# EAGLE board proiect (EAGLE 9.7.0)
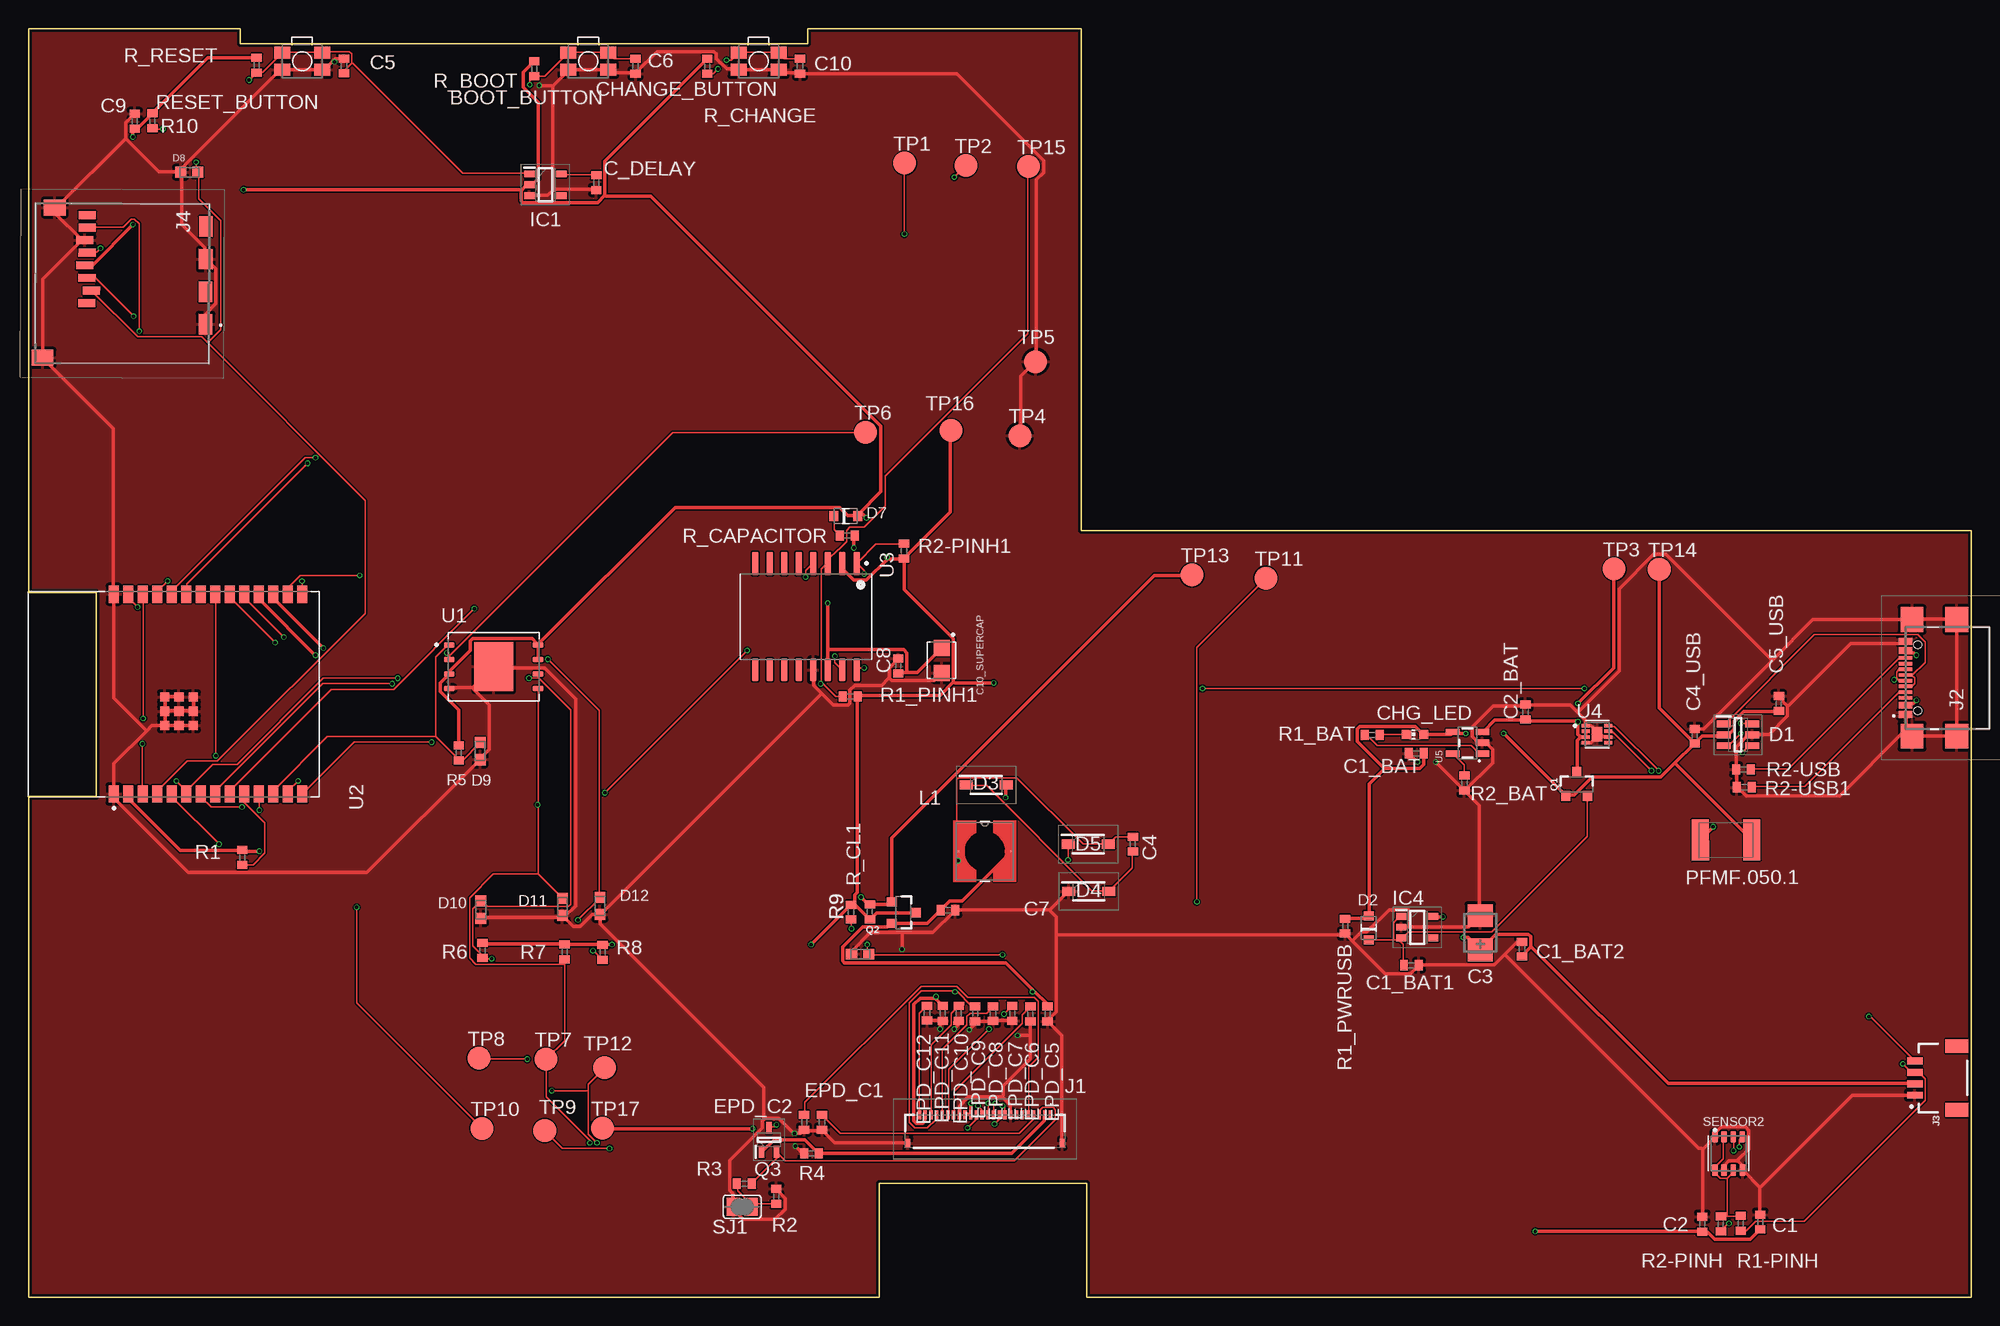
[diagram p1: board, top side]
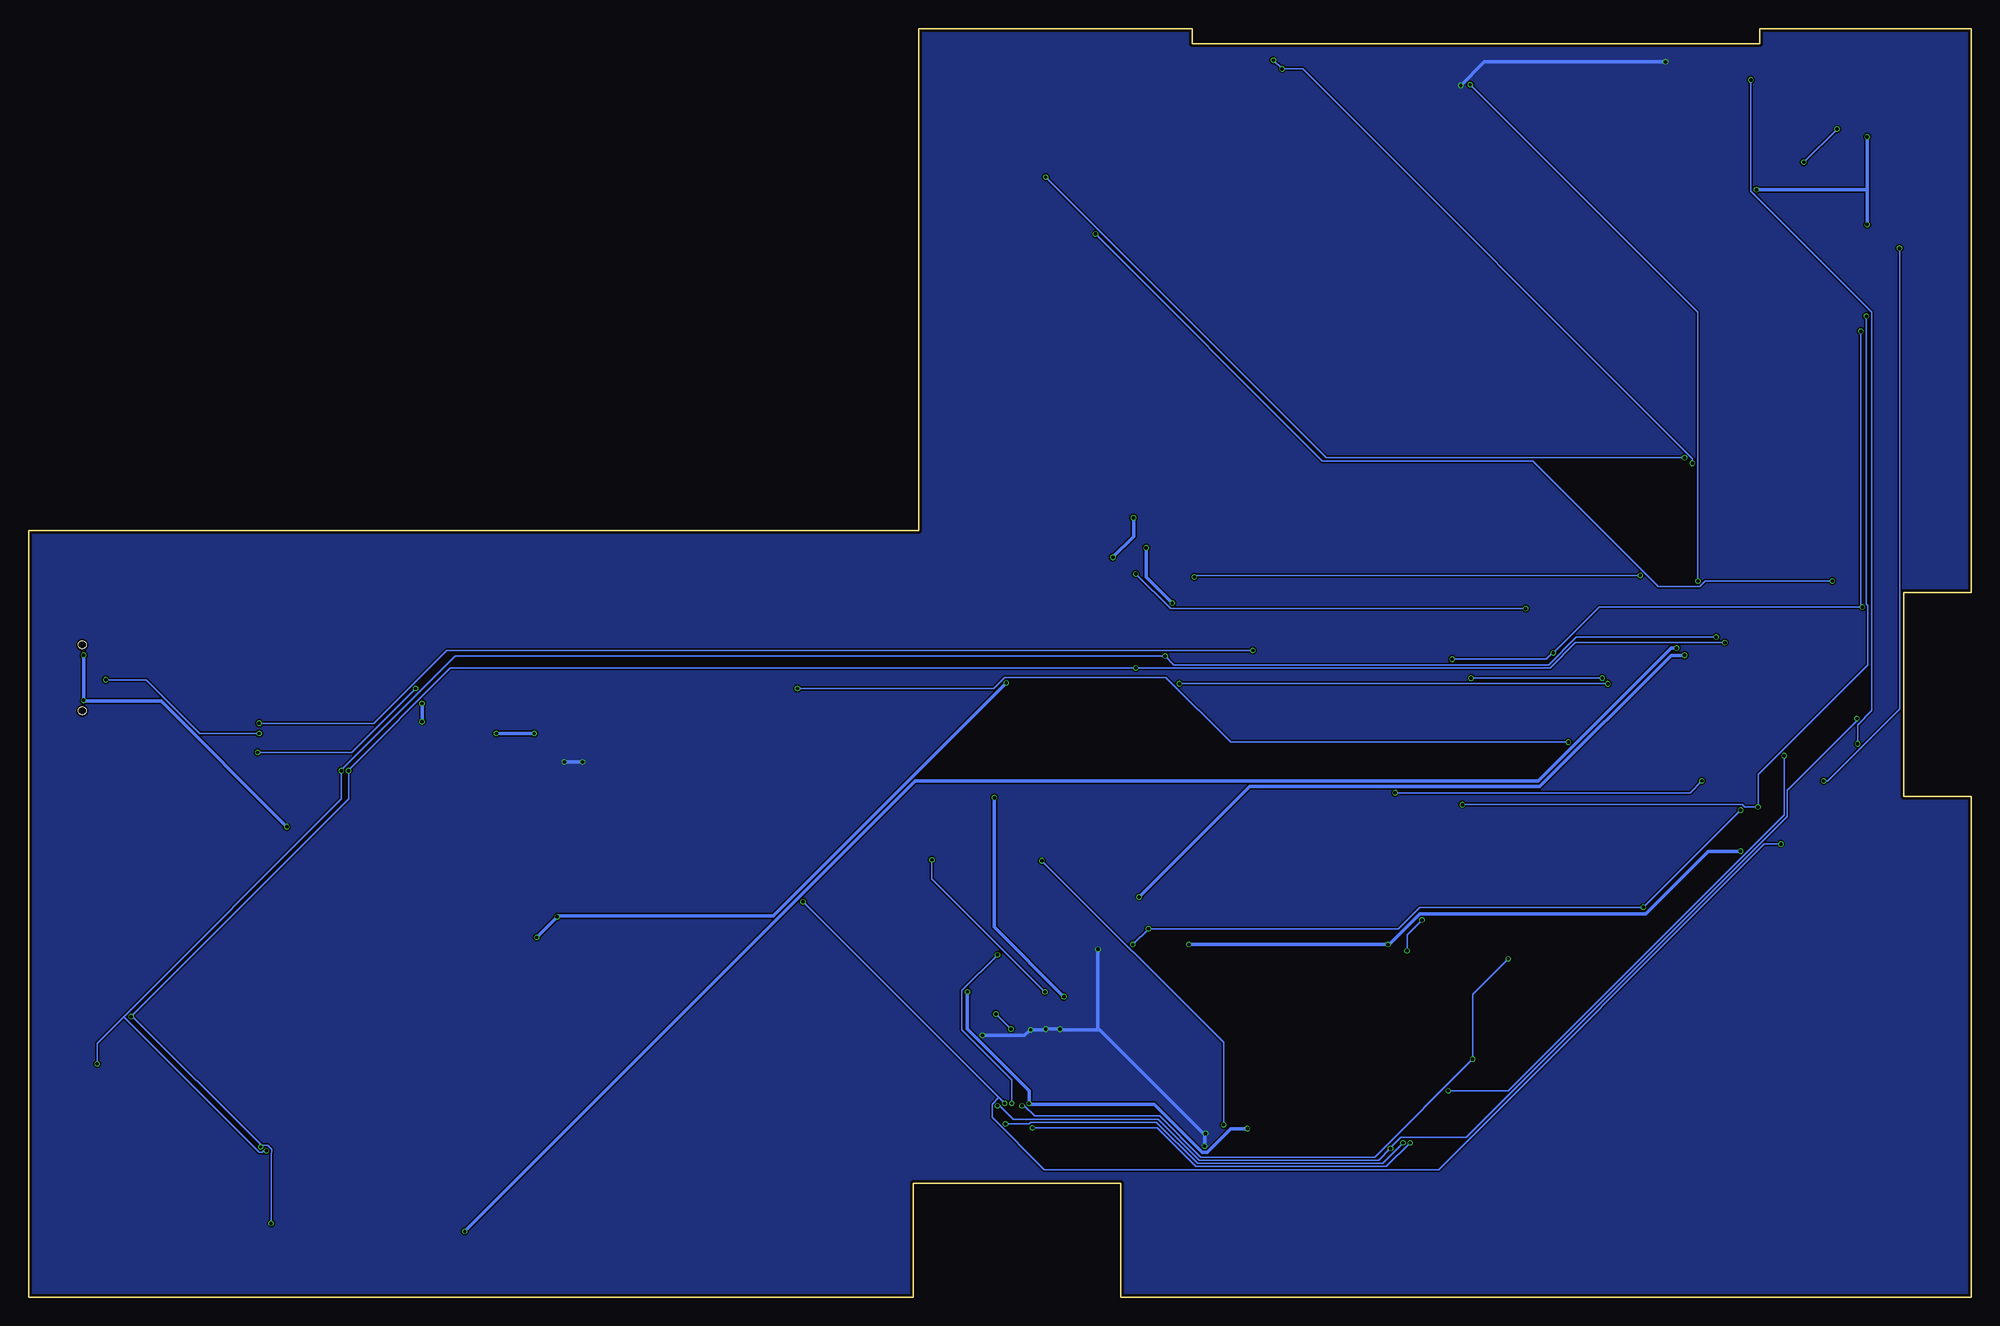
[diagram p2: board, bottom side, seen from below]

Size 170.2 x 111.2 mm. Coordinates in mm from the lower left corner, seen from the top.
Outline: 0,111.2 0,61.76 5.95,61.76 5.95,43.89 0,43.89 0,0 74.52,0 74.52,10 92.72,10 92.72,0 170.2,0 170.2,67.2 92.2,67.2 92.2,111.2 68.28,111.2 68.28,109.88 18.55,109.88 18.55,111.2 0,111.2
Copper layers (1*16): Top 0.035mm / dielectric 1.6mm / Bottom 0.035mm
Design rules "jlcpcb-2layers.dru": minimum track width 0.15mm, minimum drill 0.3mm, track to track 5mil, track to pad 5mil, pad to pad 5mil, via to via 5mil, smd to smd 5mil, copper to edge 0.2mm, drill to drill 6mil, minimum pad ring 10mil, minimum via ring 3mil, stop-mask expansion 4mil, vias tented up to drill 0mil, thermal gap 10mil
Net classes: 1 Power: width 0.3 mm; 2 wire: width 0.3 mm

## Footprints (pad centres in the part's own frame; a part is rotated, then mirrored left to right if it is on the bottom)
MYBUTTON = smd 1.4 x 1.05: 1 1.75,0.75; 2 -1.75,0.75; 3 -1.75,-0.75; 4 1.75,-0.75
EAGLE-LTSPICE_C0402 = smd 0.7 x 0.9: 1 -0.65,0; 2 0.65,0
RCL_CT3528 = smd 2 x 2.2: + -1.5,0; - 1.5,0
CAPCP3225X100N = smd 1.4 x 1.4: 1 -1.1,0; 2 1.1,0
ADAFRUIT_CHIP-LED0603 = smd 0.8 x 0.8: A 0,-0.75; C 0,0.75
SOT95P280X145-6N = smd 1.2 x 0.6: 1 -1.25,0.95; 2 -1.25,0; 3 -1.25,-0.95; 4 1.25,-0.95; 5 1.25,0; 6 1.25,0.95
ESP32_WROVER_AVX---SD0805S020S1R0_AVX_SD0805S020S1R0_0 = smd 0.8 x 0.9: 1 -1.05,0; 2 1.05,0
SOD3716X135N = smd 1.15 x 0.8: 1 -1.75,0; 2 1.75,0
DIOC1608X36N = smd 0.97 x 0.94: 1 -0.75,0; 2 0.75,0
SOT95P280X125-5N = smd 0.9 x 0.6: 1 -1.4,0.95; 2 -1.4,0; 3 -1.4,-0.95; 4 1.4,-0.95; 5 1.4,0.95
SOT95P280X120-5N = smd 0.9 x 0.6: 1 -1.4,0.95; 2 -1.4,0; 3 -1.4,-0.95; 4 1.4,-0.95; 5 1.4,0.95
FH34SRJ24S05SH99 = smd 0.3 x 0.8: 1 5.75,1.45; 2 5.25,1.45; 3 4.75,1.45; 4 4.25,1.45; 5 3.75,1.45; 6 3.25,1.45; 7 2.75,1.45; 8 2.25,1.45; 9 1.75,1.45; 10 1.25,1.45; 11 0.75,1.45; 12 0.25,1.45; 13 -0.25,1.45; 14 -0.75,1.45; 15 -1.25,1.45; 16 -1.75,1.45; 17 -2.25,1.45; 18 -2.75,1.45; 19 -3.25,1.45; 20 -3.75,1.45; 21 -4.25,1.45; 22 -4.75,1.45; 23 -5.25,1.45; 24 -5.75,1.45 | smd 0.4 x 0.8: MP1 6.75,-1.05; MP2 -6.75,-1.05
SAMACSYS_PARTS_USB4110GFA = smd 0.3 x 1.15: A1 -3.35,3.678; A4 -2.55,3.678; A5 -1.25,3.678; A6 -0.25,3.678; A7 0.25,3.678; A8 1.25,3.678; A9 2.55,3.678; A12 3.35,3.678; B1 3.05,3.678; B4 2.25,3.678; B5 1.75,3.678; B6 0.75,3.678; B7 -0.75,3.678; B8 -1.75,3.678; B9 -2.25,3.678; B12 -3.05,3.678 | smd 2.18 x 2: MP1 -5.11,-0.827; MP2 5.11,-0.827; MP3 -5.11,3.103; MP4 5.11,3.103 | hole 0.65: -2.89,2.603; 2.89,2.603
JST04_1MM_RA = smd 0.6 x 1.35: 1 -1.5,0; 2 -0.5,0; 3 0.5,0; 4 1.5,0 | smd 1.2 x 2: NC1 2.8,-3.675; NC2 -2.8,-3.675
112ATAARR03ATTEND = smd 1.8 x 1.2: G1 10.6,10.4; G2 4.9,10.4; S1 7.75,10.4; S2 2.05,10.4 | smd 1.4 x 1.9: G3 13.6,-3.85; G4 0.45,-2.85 | smd 0.7 x 1.5: P1 8.8,0; P2 7.7,0.4; P3 6.6,0; P4 5.5,-0.2; P5 4.4,0; P6 3.3,-0.2; P7 2.2,0; P8 1.1,0
IND_4828-WE-TPC_WRE = smd 0.127 x 0.127: 1 -2.286,0; 2 2.286,0
ESP32C6_VARISTOR_CT/CN1812 = smd 1.5 x 3.6: 1 -2.25,0; 2 2.25,0
ESP32_WROVER_SPARKFUN-DISCRETESEMI_SOT23-3 = smd 0.8 x 0.9: 1 -0.95,-1; 2 0.95,-1; 3 0,1.1
SOT65P210X110-3N = smd 1.05 x 0.5: 1 -1.05,0.65; 2 -1.05,-0.65; 3 1.05,0
ESP32_WROVER_EAGLE-LTSPICE_R0402 = smd 0.7 x 0.9: 1 -0.65,0; 2 0.65,0
ESP32_WROVER_BME680_PSON80P300X300X100-8N = smd 1.016 x 0.5: 1 1.458,1.2; 2 1.458,0.4; 3 1.458,-0.4; 4 1.458,-1.2; 5 -1.458,-1.22; 6 -1.458,-0.4; 7 -1.458,0.4; 8 -1.458,1.2
SJ = smd 1.168 x 1.6: 1 -0.762,0; 2 0.762,0
TP20R = smd 2 x 2: TP 0,0
SON127P600X800X80-9N = smd 0.94 x 0.44: 1 -3.895,1.905; 2 -3.895,0.635; 3 -3.895,-0.635; 4 -3.895,-1.905; 5 3.895,-1.905; 6 3.895,-0.635; 7 3.895,0.635; 8 3.895,1.905 | smd 3.4 x 4.3: 9 0,0
XCVR_ESP32-C6-WROOM-1-N8 = smd 1.5 x 0.9: 1 -8.75,5.26; 2 -8.75,3.99; 3 -8.75,2.72; 4 -8.75,1.45; 5 -8.75,0.18; 6 -8.75,-1.09; 7 -8.75,-2.36; 8 -8.75,-3.63; 9 -8.75,-4.9; 10 -8.75,-6.17; 11 -8.75,-7.44; 12 -8.75,-8.71; 13 -8.75,-9.98; 14 -8.75,-11.25; 15 8.75,-11.25; 16 8.75,-9.98; 17 8.75,-8.71; 18 8.75,-7.44; 19 8.75,-6.17; 20 8.75,-4.9; 21 8.75,-3.63; 22 8.75,-2.36; 23 8.75,-1.09; 24 8.75,0.18; 25 8.75,1.45; 26 8.75,2.72; 27 8.75,3.99; 28 8.75,5.26 | smd 0.8 x 0.8: 29_1 -2.755,0.79; 29_2 -1.505,0.79; 29_3 -0.255,0.79; 29_4 -2.755,-0.46; 29_5 -1.505,-0.46; 29_6 -0.255,-0.46; 29_7 -2.755,-1.71; 29_8 -1.505,-1.71; 29_9 -0.255,-1.71
SOIC127P1032X265-16N = smd 2.05 x 0.59: 1 -4.655,4.445; 2 -4.655,3.175; 3 -4.655,1.905; 4 -4.655,0.635; 5 -4.655,-0.635; 6 -4.655,-1.905; 7 -4.655,-3.175; 8 -4.655,-4.445; 9 4.655,-4.445; 10 4.655,-3.175; 11 4.655,-1.905; 12 4.655,-0.635; 13 4.655,0.635; 14 4.655,1.905; 15 4.655,3.175; 16 4.655,4.445
SON50P200X200X80-9N = smd 0.76 x 0.305: 1 -0.985,0.75; 2 -0.985,0.25; 3 -0.985,-0.25; 4 -0.985,-0.75; 5 0.985,-0.75; 6 0.985,-0.25; 7 0.985,0.25; 8 0.985,0.75 | smd 0.9 x 1.3: 9 0,0
ESP32_WROVER_SPARKFUN-IC-POWER_SOT23-5 = smd 0.55 x 1.2: 1 -0.95,-1.3; 2 0,-1.3; 3 0.95,-1.3; 4 0.95,1.3; 5 -0.95,1.3

## Placement (x,y rotation side)
BOOT_BUTTON  BUTTON_CUSYOMV1  [MYBUTTON]  49.03,108.32 180 top
C1  100nF  [EAGLE-LTSPICE_C0402]  151.69,6.61 90 top
C1_BAT  4.7uF  [EAGLE-LTSPICE_C0402]  121.57,47.69 180 top
C1_BAT1  4.7uF  [EAGLE-LTSPICE_C0402]  121.14,29.12 0 top
C1_BAT2  4.7uF  [EAGLE-LTSPICE_C0402]  130.83,30.52 90 top
C2  100nF  [EAGLE-LTSPICE_C0402]  146.61,6.43 90 top
C2_BAT  4.7uF  [EAGLE-LTSPICE_C0402]  131.13,51.3 90 top
C3  100uF TANT  [RCL_CT3528]  127.17,31.96 90 top
C4  4.7uF/25V  [EAGLE-LTSPICE_C0402]  96.74,39.73 90 top
C4_USB  100nF  [EAGLE-LTSPICE_C0402]  145.96,49.19 90 top
C5  1uF  [EAGLE-LTSPICE_C0402]  27.63,107.92 90 top
C5_USB  4.7uF  [EAGLE-LTSPICE_C0402]  153.33,52.05 90 top
C6  100nF  [EAGLE-LTSPICE_C0402]  53.17,107.89 270 top
C7  10uF  [EAGLE-LTSPICE_C0402]  80.54,33.95 0 top
C8  100nF  [EAGLE-LTSPICE_C0402]  76.18,55.34 90 top
C9  100nF  [EAGLE-LTSPICE_C0402]  9.31,103.08 90 top
C10  100nF  [EAGLE-LTSPICE_C0402]  67.58,107.89 270 top
C10_SUPERCAP  CPH3225A  [CAPCP3225X100N]  79.99,55.83 270 top
C_DELAY  100nF  [EAGLE-LTSPICE_C0402]  49.74,97.69 269.6 top
CHANGE_BUTTON  BUTTON_CUSYOMV1  [MYBUTTON]  63.96,108.32 180 top
CHG_LED  LG R971  [ADAFRUIT_CHIP-LED0603]  121.46,49.34 90 top
D1  USBLC6-2SC6Y  [SOT95P280X145-6N]  149.75,49.3 0 top
D2  ESP32_WROVER_AVX---SD0805S020S1R0_AVX_SD0805S020S1R0_0_0AVX_SD0805S020S1R0_0_0  [ESP32_WROVER_AVX---SD0805S020S1R0_AVX_SD0805S020S1R0_0]  117.4,32.39 90 top
D3  MBR0530  [SOD3716X135N]  83.89,44.91 0 top
D4  MBR0530  [SOD3716X135N]  92.88,35.59 0 top
D5  MBR0530  [SOD3716X135N]  92.83,39.73 0 top
D6  PGB1010603MR  [DIOC1608X36N]  72.84,30.09 0 top
D7  ESP32_WROVER_AVX---SD0805S020S1R0_AVX_SD0805S020S1R0_0_0AVX_SD0805S020S1R0_0_0  [ESP32_WROVER_AVX---SD0805S020S1R0_AVX_SD0805S020S1R0_0]  71.6,68.47 0 top
D8  PGB1010603MR  [DIOC1608X36N]  14.07,98.61 0 top
D9  PGB1010603MR  [DIOC1608X36N]  39.56,47.88 90 top
D10  PGB1010603MR  [DIOC1608X36N]  39.61,33.98 90 top
D11  PGB1010603MR  [DIOC1608X36N]  46.77,34.23 90 top
D12  PGB1010603MR  [DIOC1608X36N]  50.05,34.33 90 top
EPD_C1  1uF/50V  [EAGLE-LTSPICE_C0402]  69.51,15.36 90 top
EPD_C2  1uF/50V  [EAGLE-LTSPICE_C0402]  67.94,15.36 90 top
EPD_C5  1uF/50V  [EAGLE-LTSPICE_C0402]  89.27,24.86 90 top
EPD_C6  1uF/50V  [EAGLE-LTSPICE_C0402]  87.76,24.84 90 top
EPD_C7  1uF/50V  [EAGLE-LTSPICE_C0402]  86.17,24.88 90 top
EPD_C8  1uF/50V  [EAGLE-LTSPICE_C0402]  84.49,24.88 90 top
EPD_C9  1uF/50V  [EAGLE-LTSPICE_C0402]  82.92,24.87 90 top
EPD_C10  1uF/50V  [EAGLE-LTSPICE_C0402]  81.49,24.9 89.2 top
EPD_C11  1uF/50V  [EAGLE-LTSPICE_C0402]  80.08,24.91 90 top
EPD_C12  1uF/50V  [EAGLE-LTSPICE_C0402]  78.71,24.91 90 top
IC1  BD5229G-TR  [SOT95P280X125-5N]  45.28,97.5 0 top
IC4  XC6220A331MR-G  [SOT95P280X120-5N]  121.65,32.45 0 top
J1  FH34SRJ-24S-0.5SH_99_  [FH34SRJ24S05SH99]  83.79,14.55 0 top
J2  SAMACSYS_PARTS_USB4110-GF-A  [SAMACSYS_PARTS_USB4110GFA]  168.1,54.3 90 top
J3  QWIIC_RIGHT_ANGLE  [JST04_1MM_RA]  165.25,19.23 90 top
J4  112A-TAAR-R03_ATTEND  [112ATAARR03ATTEND]  5.15,95.95 269.7 top
L1  744043680IND_4828-WE-TPC_WRE  [IND_4828-WE-TPC_WRE]  83.77,39.11 0 top
PFMF.050.1  ESP32C6_VARISTORCN1812  [ESP32C6_VARISTOR_CT/CN1812]  148.7,40.09 0.3 top
Q1  20V/4.2A/52mΩ/1.4W  [ESP32_WROVER_SPARKFUN-DISCRETESEMI_SOT23-3]  135.62,44.95 0 top
Q2  20V/4.2A/52mΩ/1.4W  [ESP32_WROVER_SPARKFUN-DISCRETESEMI_SOT23-3]  76.61,33.73 270 top
Q3  SI1308EDL-T1-GE3  [SOT65P210X110-3N]  64.86,13.82 90 top
R1  10K  [ESP32_WROVER_EAGLE-LTSPICE_R0402]  18.73,38.55 90 top
R1-PINH  10K  [ESP32_WROVER_EAGLE-LTSPICE_R0402]  149.98,6.5 90 top
R1_BAT  200  [ESP32_WROVER_EAGLE-LTSPICE_R0402]  117.71,49.29 0 top
R1_PINH1  10K  [ESP32_WROVER_EAGLE-LTSPICE_R0402]  71.97,52.66 0 top
R1_PWRUSB  100K  [ESP32_WROVER_EAGLE-LTSPICE_R0402]  115.33,32.53 90 top
R2  2.2  [ESP32_WROVER_EAGLE-LTSPICE_R0402]  65.5,8.86 270 top
R2-PINH  10K  [ESP32_WROVER_EAGLE-LTSPICE_R0402]  148.25,6.45 90 top
R2-PINH1  10K  [ESP32_WROVER_EAGLE-LTSPICE_R0402]  76.69,65.42 270 top
R2-USB  5K1  [ESP32_WROVER_EAGLE-LTSPICE_R0402]  150.23,46.28 180 top
R2-USB1  5k1  [ESP32_WROVER_EAGLE-LTSPICE_R0402]  150.31,44.72 0 top
R2_BAT  2K  [ESP32_WROVER_EAGLE-LTSPICE_R0402]  125.79,45.08 90 top
R3  0.47  [ESP32_WROVER_EAGLE-LTSPICE_R0402]  62.71,9.98 180 top
R4  10K  [ESP32_WROVER_EAGLE-LTSPICE_R0402]  68.59,12.62 180 top
R5  10K  [ESP32_WROVER_EAGLE-LTSPICE_R0402]  37.69,47.72 90 top
R6  10K  [ESP32_WROVER_EAGLE-LTSPICE_R0402]  39.77,30.41 90 top
R7  10K  [ESP32_WROVER_EAGLE-LTSPICE_R0402]  46.96,30.29 90 top
R8  10K  [ESP32_WROVER_EAGLE-LTSPICE_R0402]  50.29,30.25 90 top
R9  10K  [ESP32_WROVER_EAGLE-LTSPICE_R0402]  72.05,33.77 90 top
R10  10K  [ESP32_WROVER_EAGLE-LTSPICE_R0402]  10.85,103.11 90 top
R_BOOT  10K  [ESP32_WROVER_EAGLE-LTSPICE_R0402]  44.3,107.67 270 top
R_CAPACITOR  15  [ESP32_WROVER_EAGLE-LTSPICE_R0402]  71.71,66.78 0 top
R_CHANGE  10K  [ESP32_WROVER_EAGLE-LTSPICE_R0402]  59.46,107.89 270 top
R_CL1  10K  [ESP32_WROVER_EAGLE-LTSPICE_R0402]  73.7,33.8 90 top
R_RESET  10K  [ESP32_WROVER_EAGLE-LTSPICE_R0402]  19.98,107.98 270 top
RESET_BUTTON  BUTTON_CUSYOMV1  [MYBUTTON]  23.97,108.32 180 top
SENSOR2  ESP32_WROVER_BME680_BME680  [ESP32_WROVER_BME680_PSON80P300X300X100-8N]  148.93,12.62 90 top
SJ1  [SJ]  62.52,7.95 0 top
TP1  TPTP20R  [TP20R]  76.75,99.41 0 top
TP2  TPTP20R  [TP20R]  82.12,99.2 0 top
TP3  TPTP20R  [TP20R]  138.89,63.84 0 top
TP4  TPTP20R  [TP20R]  86.84,75.53 0 top
TP5  TPTP20R  [TP20R]  88.22,82 0 top
TP6  TPTP20R  [TP20R]  73.33,75.83 0 top
TP7  TPTP20R  [TP20R]  45.32,20.89 0 top
TP8  TPTP20R  [TP20R]  39.45,20.96 0 top
TP9  TPTP20R  [TP20R]  45.22,14.62 0 top
TP10  TPTP20R  [TP20R]  39.71,14.8 0 top
TP11  TPTP20R  [TP20R]  108.4,63.04 0 top
TP12  TPTP20R  [TP20R]  50.46,20.12 0 top
TP13  TPTP20R  [TP20R]  101.92,63.33 0 top
TP14  TPTP20R  [TP20R]  142.85,63.8 0 top
TP15  TPTP20R  [TP20R]  87.58,99.09 0 top
TP16  TPTP20R  [TP20R]  80.81,75.97 0 top
TP17  TPTP20R  [TP20R]  50.26,14.83 0 top
U1  W25Q512JVEIQ  [SON127P600X800X80-9N]  40.75,55.27 0 top
U2  ESP32-C6-WROOM-1-N8  [XCVR_ESP32-C6-WROOM-1-N8]  12.72,52.88 90 top
U3  DS3231SN#  [SOIC127P1032X265-16N]  68.1,59.66 270 top
U4  MAX17048G+T10  [SON50P200X200X80-9N]  137.4,49.36 0 top
U5  ESP32_WROVER_SPARKFUN-IC-POWER_MCP73831  [ESP32_WROVER_SPARKFUN-IC-POWER_SOT23-5]  126.06,48.61 90 top

## Tracks (layer width: path | path; a pad name or v marks a point on that pad's centre or on a via)
3V3  (via drill 0.3)
  Top 0.3: R_RESET.1 19.94,108.63 15.72,108.63 10.94,103.85 R10.2 10.8,103.71 9.56,102.47 9.35,102.47 C9.1 9.21,102.33 9.14,102.26 v9.14,101.7 | v9.14,94.02 5.61,90.49 4.99,90.49 J4.P4 | R_BOOT.1 44.25,108.28 43.35,107.38 43.35,106.07 44.67,104.75 44.67,98.03 44.18,97.55 43.9,97.55 IC1.2 43.77,97.41 43.56,97.41 43.14,97 | 50.48,96.58 50.48,99.56 59.42,108.49 R_CHANGE.1 | 50.48,96.58 49.86,95.96 43.28,95.96 43.14,96.09 43.14,97 | R5.2 37.67,48.38 37.67,51.5 36.08,53.09 36.08,53.85 36.84,54.61 U1.3 36.91,54.75 36.91,54.89 38.71,56.69 38.71,57.52 38.92,57.73 44.11,57.73 44.53,57.31 U1.8 | D7.2 72.64,68.53 71.74,68.53 71.05,69.23 56.65,69.23 44.67,57.25 U1.8 | U1.7 44.67,55.93 44.67,57.04 U1.8 | 50.48,96.58 50.62,96.51 54.5,96.51 74.65,76.36 74.65,70.61 72.71,68.67 D7.2 | v18.84,97.06 43,97.06 43.14,97 | v123.89,33.36 123.06,33.36 IC4.5 | v125.69,31.55 126.1,31.55 127.14,30.52 C3.+ 127.28,30.58 128.53,31.83 131.37,31.83 131.57,31.62 131.57,30.72 | 131.57,30.72 130.88,30.03 130.88,29.89 C1_BAT2.1 | J3.2 165.23,18.74 143.62,18.74 131.71,30.65 131.57,30.72 | 75.28,64.72 76.66,64.72 R2-PINH1.2 | 75.28,64.72 73.41,62.86 72.3,62.86 71.33,63.82 71.33,64.31 U3.2 | TP16.TP 80.75,75.94 80.75,68.81 76.8,64.86 R2-PINH1.2 | U2.2 8.79,44.09 8.79,43.67 13.3,39.17 18.7,39.17 R1.2 18.84,39.1 v20.22,39.1 | R6.2 39.82,31 46.88,31 R7.2 47.02,30.93 50.28,30.93 R8.2 50.41,30.93 v51.11,30.93 | R9.2 72.09,34.39 72.44,34.39 73.68,33.15 R_CL1.1 73.82,33.22 74.31,33.7 77.7,33.7 Q2.3 | R9.2 72.37,34.53 72.37,35.29 72.57,35.5 72.57,52.61 R1_PINH1.2 72.71,52.74 79.84,52.74 81.02,53.92
  Top 0.3: v68.56,30.93 71.95,34.32 R9.2 | 81.02,53.92 81.02,57.73 76.73,62.02 76.73,64.59 R2-PINH1.2 | v84.55,53.85 81.16,53.85 81.02,53.92 | v73.41,68.33 72.99,68.74 D7.2 | v75.21,64.86 75.28,64.72
  Bottom 0.3: v9.14,101.7 9.14,97.06 | 9.14,97.06 v9.14,94.02 | v18.84,97.06 9.14,97.06 | v125.69,31.55 v123.89,33.36 123.75,33.42 104.98,33.42 v84.55,53.85 | v68.56,30.93 v51.11,30.93 50.97,31 48.34,33.63 28.53,33.63 23.06,39.1 v20.22,39.1 | v73.41,68.33 73.41,66.66 v75.21,64.86
12C_PW
  Top 0.15: 148.82,7.11 149.93,7.11 R1-PINH.2 | 148.82,7.11 148.26,7.11 R2-PINH.2 | 148.82,10.43 148.19,10.43 147.78,10.85 147.78,11.12 SENSOR2.8 147.78,11.19 147.78,11.47 148.47,12.16 148.47,14.03 SENSOR2.2 | 148.82,10.43 149.3,10.92 149.3,11.12 SENSOR2.6 | 148.82,10.43 148.82,7.11
32KHZ  (via drill 0.3)
  Top 0.15: R2-PINH1.1 76.66,66.04 74.24,66.04 72.57,64.38 U3.1 72.57,64.31 73.2,63.69 v73.2,63.41 | v39.06,60.36 31.99,53.3 26.52,53.3 17.66,44.43 17.66,44.16 U2.9
  Bottom 0.15: v39.06,60.36 70.15,60.36 v73.2,63.41
DN
  Top 0.15: 164.99,54.51 164.95,54.55 J2.A7 | 164.99,54.51 165.23,54.27 165.23,53.78 165.02,53.58 164.47,53.58 J2.B7 | 164.99,54.51 166.13,55.65 166.13,57.45 165.51,58.08 156.44,58.08 148.68,50.32 148.54,50.32 D1.1
DP  (via drill 0.3)
  Top 0.15: 163.64,54.27 163.84,54.06 164.4,54.06 J2.A6 | 163.64,54.27 163.64,54.82 163.84,55.03 164.4,55.03 J2.B6 | v150,49.42 148.96,48.38 148.54,48.38 D1.3 | v163.43,54.13 163.57,54.27 163.64,54.27
  Bottom 0.15: v150,49.42 155.19,49.42 159.9,54.13 v163.43,54.13
EPD_3V3  (via drill 0.3)
  Top 0.3: J1.16 82.06,16.04 82.48,16.04 J1.15 82.55,16.18 v82.55,17.01 | 88.05,26.88 85.59,29.34 71.47,29.34 71.33,29.48 71.33,30.72 73.06,32.45 75.21,32.45 75.48,32.73 Q2.2 75.62,32.8 78.74,32.8 79.84,33.91 C7.1 79.98,34.05 80.68,34.74 81.78,34.74 86.01,38.96 86.01,39.1 L1.2 | 88.05,26.88 89.26,25.67 89.26,25.53 EPD_C5.2 | v87.95,26.78 88.05,26.88 | v63.43,14.79 50.28,14.79 TP17.TP
  Bottom 0.3: v87.95,26.78 87.95,23.52 82.55,18.12 v82.55,17.01 82.41,16.94 71.61,16.94 67.38,12.72 66.97,12.72 64.89,14.79 v63.43,14.79
EPD_3V3_C  (via drill 0.3)
  Top 0.3: v25.14,56.28 20.22,61.19 20.22,61.61 U2.18 | v72.92,35.09 73.54,34.46 R_CL1.2 73.75,34.46 75.34,34.46 75.55,34.67 Q2.1 75.62,34.81 75.62,40.28 98.61,63.27 101.87,63.27 TP13.TP
  Bottom 0.3: v25.14,56.28 26.32,56.28 37.81,44.78 63.23,44.78 v72.92,35.09
EPD_BUSY  (via drill 0.3)
  Top 0.15: v85.32,16.8 85.52,16.6 85.52,16.04 J1.9 | v50.9,13.06 46.74,13.06 45.22,14.59 TP9.TP | v10.04,50.74 10.04,61.61 U2.26
  Bottom 0.15: v85.32,16.8 85.11,16.8 83.93,15.63 71.26,15.63 67.66,12.03 51.94,12.03 v50.9,13.06 50.9,13.13 50,14.03 44.25,14.03 16.14,42.15 16.14,44.43 10.04,50.53 v10.04,50.74
EPD_CS  (via drill 0.3)
  Top 0.15: v84.07,17.01 84.07,16.04 J1.12 | v85.32,30.03 73.61,30.03 D6.2 73.54,30.1 73.47,30.17 v73.47,30.93 | v72.09,32.32 72.09,33.08 R9.1 | v20.22,42.7 20.22,44.09 U2.11 | v28.74,34.19 28.74,25.81 39.68,14.87 TP10.TP
  Bottom 0.15: v84.07,17.01 84.07,19.09 88.43,23.45 88.43,26.91 v85.32,30.03 | v73.47,30.93 v72.09,32.32 50.21,32.32 48.34,34.19 v28.74,34.19 v20.22,42.7
EPD_DC  (via drill 0.3)
  Top 0.15: v84.69,17.01 84.55,16.87 84.55,16.04 J1.11 | v102.35,34.67 102.35,56.97 108.38,62.99 TP11.TP | v16.69,39.73 12.6,43.81 12.6,44.09 U2.5
  Bottom 0.15: v102.35,34.67 85.21,17.53 | 85.21,17.53 v84.69,17.01 | v16.69,39.73 18.14,39.73 46.67,11.19 81.23,11.19 85.8,15.77 85.8,16.94 85.21,17.53
EPD_RST  (via drill 0.3)
  Top 0.15: v84.62,15.21 85.04,15.63 85.04,15.97 J1.10 | v49.79,13.55 49.03,14.31 49.03,18.12 | 49.03,18.12 49.03,18.67 50.41,20.06 TP12.TP | v16.41,47.48 16.41,61.61 U2.21 | 49.03,18.12 v45.84,18.12
  Bottom 0.15: v84.62,15.21 82.55,15.21 82.41,15.35 71.4,15.35 67.8,11.75 51.59,11.75 v49.79,13.55 | v16.41,47.48 16.41,42.29 40.58,18.12 v45.84,18.12
FLASH_CS
  Top 0.15: D9.2 39.54,48.59 38.02,47.07 37.74,47.07 R5.1 37.67,47.14 35.66,49.14 | 35.66,49.14 35.66,56.14 36.7,57.18 U1.1 | 35.66,49.14 26.18,49.14 21.47,44.43 21.47,44.16 U2.12
GDR
  Top 0.3: J1.2 88.99,15.97 88.99,15.49 86.15,12.65 69.25,12.65 R4.1 69.11,12.72 68,13.83 65.3,13.83 64.26,12.79 Q3.1
GND  (via drill 0.3)
  Top 0.3: TP4.TP 86.91,75.53 86.91,80.72 88.16,81.97 TP5.TP 88.29,82.11 88.29,97.97 88.92,98.59 88.92,99.63 81.3,107.24 67.73,107.24 C10.2 67.52,107.31 65.93,107.31 65.72,107.52 CHANGE_BUTTON.2 65.58,107.59 62.26,107.59 CHANGE_BUTTON.1 62.12,107.66 61.15,107.66 60.25,108.56 60.25,108.97 60.04,109.18 55.05,109.18 53.25,107.38 C6.2 53.12,107.31 51.04,107.31 50.83,107.52 BOOT_BUTTON.2 50.69,107.59 47.3,107.59 BOOT_BUTTON.1 47.23,107.45 45.91,106.14 | 46.05,97.13 45.5,96.58 43.9,96.58 IC1.3 | 46.05,97.13 49.65,97.13 49.72,97.06 C_DELAY.2 | 45.91,106.14 45.91,98.03 45.98,97.97 45.98,97.27 46.05,97.13 | U2.29_1 11.98,50.11 13.16,50.11 U2.29_4 13.3,50.11 14.4,50.11 U2.29_7 | U2.29_2 11.98,51.36 11.98,50.25 U2.29_1 | U2.29_2 12.12,51.43 13.16,51.43 U2.29_5 13.3,51.43 14.4,51.43 U2.29_8 14.47,51.57 14.47,52.61 U2.29_9 | U2.29_2 11.98,51.5 11.98,52.61 U2.29_3 12.12,52.67 13.16,52.67 U2.29_6 | 10.35,49.66 10.8,50.11 11.77,50.11 U2.29_1 | 10.35,49.66 7.48,46.79 7.48,44.16 U2.1 7.55,44.02 7.55,43.67 13.99,37.23 29.64,37.23 39.47,47.07 D9.1 39.61,47.14 39.61,47.27 40.37,48.04 40.37,51.91 38.99,53.3 38.92,53.44 | 10.35,49.66 7.48,52.54 7.48,61.61 U2.28 7.41,61.75 7.41,76.15 1.32,82.25 J4.G3 1.25,82.38 1.25,89.24 4.57,92.56 J4.P6 4.92,92.7 4.64,92.7 2.35,94.99 2.35,95.47 J4.G4 2.49,95.54 8.52,101.57 | J4.G1 15.51,85.29 15.51,86.19 16.41,87.09 16.41,90.14 15.58,90.97 J4.G2 15.44,91.11 15.44,92.01 13.43,94.02 13.43,98.52 D8.1 | 26.7,108.39 25.9,107.59 25.76,107.59 RESET_BUTTON.2 25.62,107.59 22.23,107.59 RESET_BUTTON.1 22.09,107.52 21.95,107.52 13.23,98.8 D8.1
  Top 0.3: 26.7,108.39 26.87,108.56 27.56,108.56 C5.2 | 8.52,101.57 8.52,102.95 9.28,103.71 C9.2 | 8.52,101.57 11.43,98.66 13.3,98.66 D8.1 | v44.74,106.21 45.77,106.21 45.91,106.14 | v26.8,108.28 26.7,108.39 | J1.MP1 90.51,13.55 90.51,22.97 89.33,24.14 EPD_C5.1 89.33,24.35 90.03,25.05 90.03,31.76 | 89.47,33.98 81.23,33.98 C7.2 81.09,33.84 79.22,31.97 76.52,31.97 | 89.47,33.98 91.06,35.57 D4.1 | 76.52,31.97 73.75,31.97 72.16,30.38 72.16,30.1 D6.1 | 90.03,31.76 90.03,33.36 89.54,33.84 89.47,33.98 | 38.92,53.44 36.91,53.44 U1.4 | 38.92,53.44 40.72,55.24 U1.9 40.86,55.17 45.22,55.17 47.92,52.47 47.92,34.32 47.02,33.42 D11.1 | 75.41,54.27 75.41,55.17 76.17,55.93 C8.2 | 75.41,54.27 75.62,54.06 79.36,54.06 79.98,54.68 C10_SUPERCAP.2 | 69.49,52.92 70.5,51.91 71.81,51.91 71.95,52.05 71.95,53.23 72.37,53.65 74.72,53.65 75.28,54.2 75.41,54.27 | 69.49,52.92 68.77,53.65 68.77,54.96 U3.13 | 85.32,17.57 82.34,17.57 81.58,16.8 81.58,16.04 J1.17 | 85.32,17.57 86.01,16.87 86.01,16.04 J1.8 | 87.74,22.97 87.74,20.89 85.39,18.54 85.39,17.7 85.32,17.57 | 87.74,22.97 87.74,24.14 EPD_C6.1 | D10.1 39.61,33.28 46.6,33.28 46.74,33.42 D11.1 | D12.1 50,33.56 49.38,33.56 48.34,32.52 47.71,32.52 46.88,33.36 D11.1 | EPD_C12.1 78.74,24.28 80.05,24.28 EPD_C11.1 79.84,24.14 v79.84,23.52 | v81.09,23.52 81.44,23.87 81.44,24.21 EPD_C10.1 | EPD_C7.1 86.15,24.28 84.62,24.28 EPD_C8.1 84.48,24.21 82.96,24.21 EPD_C9.1 83.03,24.08 v82.41,23.45 | R2.1 65.51,9.46 66.27,8.7 66.27,7.73 65.37,6.83 62.6,6.83 61.77,7.66 61.77,7.94 SJ1.1 61.7,8.08 61.7,9.12 61.42,9.39 61.42,12.03 64.26,14.87 64.26,15.49 64.47,15.7
  Top 0.3: v67.17,13.27 67.8,12.65 67.93,12.65 R4.2 | J1.MP2 77.01,13.55 70.64,13.55 69.53,14.66 EPD_C1.1 69.39,14.59 68.07,14.59 EPD_C2.1 67.93,14.66 67.66,14.38 v67.1,14.38 66.97,14.45 65.72,15.7 64.47,15.7 | D12.1 50.07,33.42 50.07,32.73 64.4,18.4 64.4,15.83 64.47,15.7 | v86.63,22.97 87.74,22.97 | 69.49,52.92 50.14,33.56 D12.1 | v76.52,30.52 76.52,31.97 | J2.A12 164.4,57.59 164.4,57.38 J2.B1 164.26,57.31 159.62,57.31 154.22,51.91 154.08,51.84 | 154.08,51.84 153.39,52.54 153.39,52.67 C5_USB.2 | 154.08,51.84 154.08,50.94 152.49,49.35 151.03,49.35 D1.5 150.9,49.21 150.55,49.21 149.58,48.24 R2-USB.2 149.58,46.23 149.65,46.17 149.65,44.78 R2-USB1.1 149.79,44.64 150.48,43.95 158.65,43.95 164.33,49.63 J2.MP3 | J2.B12 164.4,51.22 164.4,51.01 J2.A1 164.47,50.81 164.47,49.7 164.95,49.21 J2.MP3 | J2.MP3 165.09,49.21 168.9,49.21 J2.MP1 168.9,49.35 168.9,59.25 J2.MP2 168.9,59.46 165.09,59.46 J2.MP4 164.95,59.39 156.3,59.39 152.73,55.83 | 152.73,55.83 146.74,49.84 145.98,49.84 C4_USB.2 | 146.67,13 146.67,7.11 C2.2 | 146.67,13 147.71,14.03 SENSOR2.1 147.85,14.17 147.85,14.52 148.26,14.93 150.41,14.93 150.69,14.66 150.69,13 149.79,12.1 149.72,11.96 | 151.66,9.67 151.66,7.32 C1.2 | 151.66,9.67 150.2,11.12 SENSOR2.5 150.06,11.26 150.06,11.61 149.72,11.96 | 149.72,11.96 148.96,11.96 148.54,11.54 148.54,11.19 SENSOR2.7 | J3.1 165.23,17.7 159.76,17.7 151.8,9.74 151.66,9.67 | 120.98,32.45 126.17,32.45 127.14,33.42 C3.- 127.07,33.56 127.07,43.12 125.9,44.3 R2_BAT.1 | 120.98,32.45 120.29,32.45 IC4.2 | 115.96,31.24 115.37,31.83 R1_PWRUSB.1 115.23,31.76 90.03,31.76 | 115.96,31.24 118.83,28.37 121.05,28.37 121.74,29.06 C1_BAT1.2 121.88,29.13 128.39,29.13 129.32,30.07
  Top 0.3: 129.32,30.07 130.4,31.14 130.81,31.14 C1_BAT2.2 | 120.98,32.45 120.98,33.84 120.84,33.98 119.18,33.98 117.24,32.04 116.75,32.04 115.96,31.24 | U4.4 136.42,48.59 136.84,48.59 137.39,49.14 U4.9 | 136.42,50.11 136.84,50.11 137.46,49.49 U4.9 | 136.42,50.11 U4.1 | U4.6 138.36,49.14 137.53,49.14 U4.9 | 135.69,51.26 136.35,50.6 136.35,50.25 136.42,50.11 | 135.69,51.26 135.04,51.91 131.16,51.91 C2_BAT.2 131.02,51.84 128.32,51.84 126.45,49.97 126.45,49.14 127,48.59 127.21,48.59 U5.2 127.42,48.59 127.7,48.59 128.25,48.04 128.25,46.86 125.83,44.43 R2_BAT.1 | v121.67,46.93 120.98,47.62 C1_BAT.2 | v123.27,46.93 125.69,44.5 R2_BAT.1 | 129.32,30.07 146.32,13.06 146.53,13.06 146.67,13 | 152.73,55.83 143.42,65.14 142.38,65.14 139.33,62.09 139.33,54.89 135.69,51.26
  Bottom 0.3: v44.74,106.21 42.66,108.28 v26.8,108.28 | v67.17,13.27 67.17,14.31 v67.1,14.38 67.31,14.38 76.38,23.45 76.52,23.45 | 76.52,23.45 79.71,23.45 v79.84,23.52 v81.09,23.52 81.23,23.45 v82.41,23.45 82.55,23.38 82.96,22.97 v86.63,22.97 | 76.52,23.45 v76.52,30.52 | v123.27,46.93 v121.67,46.93
  pour Top: 68.34,109.8 68.32,109.79 18.58,109.79 18.56,109.8 18.54,109.82 18.52,109.85 18.52,111.09 0.08,111.09 0.08,0.04 74.42,0.04 74.42,9.98 74.44,10.01 74.46,10.03 74.48,10.04 92.72,10.04 92.74,10.03 92.76,10.01 92.78,9.98 92.78,0.04 170.12,0.04 170.12,67.09 92.18,67.09 92.16,67.1 92.14,67.12 92.12,67.15 92.12,111.09 68.38,111.09 68.38,109.85 68.36,109.82
  pour Bottom: 68.34,109.8 68.32,109.79 18.48,109.79 18.46,109.8 18.44,109.82 18.42,109.85 18.42,111.09 0.08,111.09 0.08,0.04 74.42,0.04 74.42,9.98 74.44,10.01 74.46,10.03 74.48,10.04 92.72,10.04 92.74,10.03 92.76,10.01 92.78,9.98 92.78,0.04 170.12,0.04 170.12,67.09 92.18,67.09 92.16,67.1 92.14,67.12 92.12,67.15 92.12,111.09 68.38,111.09 68.38,109.85 68.36,109.82
GPIO8
  Top 0.15: R1.1 18.77,37.92 19.67,37.92 20.71,38.96 20.71,41.59 18.91,43.4 18.91,44.09 U2.10
I2C_PW  (via drill 0.3)
  Top 0.3: C1.1 151.66,5.93 150.83,5.1 147.71,5.1 147.09,5.72 146.67,5.72 C2.1 146.46,5.79 v131.99,5.79 | v25.83,56.9 21.47,61.26 21.47,61.61 U2.17
  Bottom 0.3: v25.83,56.9 26.32,56.9 37.95,45.27 92.52,45.27 v131.99,5.79
INT_RTC  (via drill 0.3)
  Top 0.15: 69.49,53.89 69.46,53.92 69.46,63.82 69.94,64.31 U3.3 70.01,64.38 70.01,64.66 70.91,65.56 70.98,65.56 71.67,66.25 71.67,67.22 71.95,67.5 73.2,67.5 75.07,69.36 75.07,72 87.53,84.46 87.53,99.07 TP15.TP | 69.49,53.89 70.7,52.67 71.26,52.67 R1_PINH1.1 | v31.86,53.78 25.76,53.78 16.41,44.43 16.41,44.16 U2.8 | 69.49,53.89 v69.39,53.78
  Bottom 0.15: v69.39,53.78 v31.86,53.78
IO/BOOT  (via drill 0.3)
  Top 0.15: C6.1 53.12,108.56 51.31,108.56 50.83,109.05 BOOT_BUTTON.3 50.76,109.11 47.3,109.11 BOOT_BUTTON.4 47.23,109.05 45.22,107.04 44.32,107.04 R_BOOT.2 44.25,106.97 43.9,106.62 v43.9,106.28 | v23.96,62.79 23.96,61.68 U2.15
  Bottom 0.15: v23.96,62.79 23.96,86.33 v43.9,106.28
IO/CHANGE  (via drill 0.3)
  Top 0.15: C10.1 67.52,108.56 66.2,108.56 65.72,109.05 CHANGE_BUTTON.3 65.65,109.11 62.26,109.11 CHANGE_BUTTON.4 62.19,109.05 61.56,108.42 v61.15,108.42 | v60.39,107.66 59.97,107.24 59.49,107.24 R_CHANGE.2 | v24.45,73.1 13.85,62.51 13.85,61.68 U2.23
  Bottom 0.15: v61.15,108.42 v60.39,107.66 58.59,107.66 24.45,73.52 v24.45,73.1
MISO  (via drill 0.3)
  Top 0.15: v49.44,30.38 49.51,30.38 50.28,29.62 R8.1 | v48.13,33.08 50.07,35.02 D12.2 50,35.09 50,51.43 v45.5,55.93 | 36.91,56.28 36.91,55.93 U1.2 | 36.91,56.28 56.44,75.81 73.27,75.81 TP6.TP | v9.56,60.5 8.79,61.26 8.79,61.61 U2.27 | v36.63,56.48 36.84,56.28 36.91,56.28 | v9.7,84.67 9.7,94.09 9.28,94.5 9,94.5 8.31,93.81 5.19,93.81 J4.P7
  Bottom 0.15: v49.44,30.38 49.44,31.76 v48.13,33.08 | v9.7,84.67 9.7,60.57 v9.56,60.5 32.62,60.5 v36.63,56.48 36.7,56.48 37.26,55.93 v45.5,55.93
MOSI  (via drill 0.3)
  Top 0.15: v82.27,14.87 83.03,15.63 83.03,15.97 J1.14 | v49.17,13.55 49.17,13.76 45.36,17.57 45.36,20.82 TP7.TP 45.36,20.89 46.95,22.48 46.95,29.2 | 46.95,29.2 46.95,29.62 R7.1 | 44.67,37.09 44.67,43.19 | 44.67,43.19 44.67,53.37 U1.5 | 44.67,37.09 46.74,35.02 D11.2 | v18.7,42.98 16,42.98 15.1,43.88 15.1,44.09 U2.7 | v44.6,43.19 44.67,43.19 | v9.21,85.98 5.89,89.31 5.12,89.31 J4.P3 | 46.95,29.2 39.2,29.2 38.64,29.75 38.64,35.02 40.72,37.09 44.67,37.09
  Bottom 0.15: v82.27,14.87 71.33,14.87 67.93,11.47 51.24,11.47 v49.17,13.55 | v44.6,43.19 20.08,43.19 19.88,42.98 v18.7,42.98 18.7,45.82 9.07,55.45 9.07,60.64 9.21,60.78 v9.21,85.98
N$1
  Top 0.15: R2-USB1.2 150.97,44.78 155.6,44.78 163.84,53.02 164.4,53.02 J2.A5
N$2
  Top 0.15: R2-USB.1 150.9,46.3 154.15,46.3 163.84,56 164.4,56 J2.B5
N$11
  Top 0.15: 119.59,31.35 120.08,31.35 120.22,31.48 IC4.3 | 119.59,31.35 117.45,31.35 D2.1 | 119.59,31.35 119.59,32.87 120.08,33.36 120.22,33.36 IC4.1 | C1_BAT1.1 120.43,29.13 120.43,30.93 120.08,31.28 IC4.3 | Q1.2 136.56,40.42 128.18,32.04 120.91,32.04 120.43,31.55 120.29,31.55 IC4.3
N$15
  Top 0.15: CHG_LED.C 118.42,49.35 R1_BAT.2
N$16
  Top 0.15: R1_BAT.1 117.1,49.28 117.24,49.28 118.14,48.38 126.38,48.38 127.07,47.69 127.35,47.69 U5.1
N$17
  Top 0.15: J1.4 88.02,15.97 88.02,15.63 86.77,14.38 71.12,14.38 69.53,15.97 EPD_C1.2
N$18
  Top 0.15: R2_BAT.2 125.76,45.75 125.76,46.65 124.79,47.62 U5.5
N$19
  Top 0.15: C4.1 96.67,39.03 96.67,37.65 94.67,35.64 D4.2 94.6,35.64 93.14,35.64 83.93,44.85 82.2,44.85 D3.1
N$20
  Top 0.15: J1.5 87.6,16.04 87.6,20.2 88.43,21.03 88.43,25.95 88.09,26.29 82.27,26.29 81.3,27.26 78.18,27.26 68,17.08 68,16.04 EPD_C2.2
N$21
  Top 0.15: J1.18 81.09,16.04 81.09,18.05 87.05,24.01 87.05,24.77 87.74,25.46 EPD_C6.2
N$22  (via drill 0.3)
  Top 0.15: v84.14,23.52 80.61,19.99 80.61,16.04 J1.19 | v85.45,24.84 86.15,25.53 EPD_C7.2
  Bottom 0.15: v85.45,24.84 v84.14,23.52
N$23
  Top 0.15: J1.20 80.05,16.04 80.05,21.72 82.2,23.87 82.2,24.63 82.48,24.91 83.93,24.91 84.48,25.46 EPD_C8.2
N$24
  Top 0.15: C_DELAY.1 49.72,98.38 46.81,98.38 46.74,98.45 IC1.5
N$25
  Top 0.15: J1.22 79.08,16.04 79.08,22.14 80.81,23.87 80.81,24.91 81.44,25.53 EPD_C10.2
N$26
  Top 0.15: J1.24 78.05,16.04 78.05,24.91 78.67,25.53 EPD_C12.2
N$29
  Top 0.15: D7.1 70.57,68.46 70.57,67.29 71.05,66.8 R_CAPACITOR.1
PREVGH  (via drill 0.3)
  Top 0.15: 81.16,26.84 81.3,26.84 82.61,25.53 82.89,25.53 EPD_C9.2 | 81.16,26.84 78.18,26.84 77.14,25.81 77.14,15.35 77.63,14.87 78.74,14.87 79.5,15.63 79.5,15.97 J1.21 | v91.06,38.34 91.06,39.66 D5.1 | v81.16,26.78 81.16,26.84
  Bottom 0.15: v91.06,38.34 91.06,36.68 v81.16,26.78
PREVGL  (via drill 0.3)
  Top 0.3: 79.43,26.22 78.11,26.22 77.56,25.67 77.56,15.49 77.77,15.28 78.32,15.28 78.53,15.49 78.53,15.97 J1.23 | 79.43,26.22 80.05,25.6 EPD_C11.2 | v85.59,43.81 85.59,44.85 D3.2 | v79.5,26.36 79.43,26.22
  Bottom 0.3: v85.59,43.81 85.59,32.45 v79.5,26.36
RESE
  Top 0.15: 65.79,12.44 65.51,12.72 Q3.2 | 65.79,12.44 66.27,11.96 86.36,11.96 89.96,15.56 89.96,16.46 89.75,16.66 88.85,16.66 88.57,16.39 88.57,16.04 J1.3 | 65.79,12.44 63.36,10.02 R3.1
RESE'
  Top 0.15: R3.2 62.12,9.95 62.12,9.32 63.23,8.22 63.23,8.01 SJ1.2 63.29,8.22 65.44,8.22 R2.2
RESET  (via drill 0.3)
  Top 0.15: 28.32,108.14 27.63,107.45 27.63,107.31 C5.1 | 28.32,108.14 28.32,108.97 28.12,109.18 25.83,109.18 25.76,109.11 RESET_BUTTON.3 25.69,109.11 22.23,109.11 RESET_BUTTON.4 22.16,109.05 20.5,107.38 20.01,107.38 R_RESET.2 19.94,107.31 v19.32,106.69 | IC1.1 43.84,98.52 38.02,98.52 28.39,108.14 28.32,108.14 | v9.97,48.52 9.97,44.16 U2.3
  Bottom 0.15: v9.97,48.52 9.97,50.18 8.73,51.43 8.73,86.33 19.32,96.93 v19.32,106.69
RTC_RST  (via drill 0.3)
  Top 0.15: v29.02,63.27 23.82,63.27 22.71,62.16 22.71,61.68 U2.16 | v68.07,63.13 68.07,63.69 68.7,64.31 U3.4
  Bottom 0.15: v29.02,63.27 67.93,63.27 v68.07,63.13
RX  (via drill 0.3)
  Top 0.15: v25.14,73.59 24.24,73.59 12.6,61.95 12.6,61.68 U2.24 | v81.09,98.17 82.06,99.14 TP2.TP
  Bottom 0.15: v25.14,73.59 56.51,73.59 v81.09,98.17
SCK  (via drill 0.3)
  Top 0.15: v83.17,16.8 83.52,16.46 83.52,16.04 J1.13 | v43.7,20.89 39.47,20.89 TP8.TP | 44.67,54.34 44.67,54.61 U1.6 | 44.67,54.34 47.51,51.5 47.51,34.46 47.3,34.25 40.16,34.25 39.68,34.74 D10.2 39.54,34.67 38.92,34.05 38.92,30.79 39.75,29.96 39.75,29.82 R6.1 39.75,29.68 v40.58,29.68 | v32.34,54.27 25.83,54.27 18.28,46.72 16.14,46.72 13.85,44.43 13.85,44.16 U2.6 13.78,44.43 v12.95,45.27 | v43.84,54.27 44.67,54.27 44.67,54.34 | v6.3,91.94 5.96,91.59 5.19,91.59 J4.P5
  Bottom 0.15: v83.17,16.8 82.96,16.8 82.06,15.9 71.12,15.9 67.52,12.3 52.28,12.3 v43.7,20.89 43.7,26.57 v40.58,29.68 | v43.84,54.27 v32.34,54.27 | v6.3,91.94 6.3,51.57 12.6,45.27 v12.95,45.27
SCL  (via drill 0.3)
  Top 0.15: v21.61,57.38 17.66,61.33 17.66,61.61 U2.20 | v73.2,55.17 72.71,55.17 72.57,55.03 U3.16 | v148.96,6.49 148.89,6.49 148.26,5.86 R2-PINH.1 | v149.86,13.2 149.86,13.83 150.06,14.03 SENSOR2.4 | v142.17,46.17 138.78,49.56 138.43,49.56 U4.7 | v161.21,24.63 161.35,24.63 165.23,20.75 J3.4
  Bottom 0.15: v21.61,57.38 34.69,57.38 36.91,55.17 v73.2,55.17 133.24,55.17 142.17,46.23 v142.17,46.17 142.17,43.67 161.15,24.7 | v148.96,6.49 148.96,12.65 148.89,12.72 148.89,13 149.23,13.34 149.72,13.34 v149.86,13.2 149.79,13.34 161.15,24.7 | 161.15,24.7 v161.21,24.63
SDA  (via drill 0.3)
  Top 0.15: v22.37,57.87 18.91,61.33 18.91,61.61 U2.19 | v70.64,56.21 70.64,55.65 71.26,55.03 U3.15 | v142.79,46.17 138.92,50.04 138.43,50.04 U4.8 | v164.19,20.47 164.88,19.78 165.23,19.78 J3.3 165.3,19.71 165.58,19.71 166.13,19.16 166.13,17.29 155.54,6.69 151.31,6.69 150.48,5.86 150,5.86 R1-PINH.1 | v149.37,12.86 149.37,14.03 SENSOR2.3
  Bottom 0.15: v22.37,57.87 34.62,57.87 37.05,55.45 69.87,55.45 v70.64,56.21 132.82,56.21 142.79,46.23 v142.79,46.17 142.79,43.67 161.87,24.59 | 161.87,24.59 164.19,22.27 v164.19,20.47 | v149.37,12.86 149.58,12.86 149.72,12.72 150,12.72 161.87,24.59
SRC  (via drill 0.3)
  Top 0.15: C4.2 96.67,40.35 95.22,40.35 94.6,39.73 D5.2 94.53,39.73 92.38,39.73 86.56,45.54 81.44,45.54 81.3,45.4 81.3,39.31 81.44,39.17 L1.1 81.44,39.1 v81.44,38.27 | v65.51,15.14 65.3,14.93 64.89,14.93 Q3.3
  Bottom 0.15: v65.51,15.14 65.51,22.34 v81.44,38.27
SS_SD  (via drill 0.3)
  Top 0.15: v11.77,102.4 10.87,102.4 R10.1 | v14.68,99.49 14.68,98.8 14.82,98.66 D8.2 14.89,98.59 14.89,96.3 16.83,94.36 16.83,84.81 15.69,83.67 | 15.69,83.67 15.17,84.18 9.56,84.18 5.54,88.2 J4.P2 | 15.69,83.67 29.5,69.85 29.5,59.95 16.55,47 13.92,47 11.29,44.37 11.29,44.16 U2.4
  Bottom 0.15: v14.68,99.49 v11.77,102.4
TX  (via drill 0.3)
  Top 0.15: v12.19,62.79 11.29,61.88 11.29,61.68 U2.25 | v76.73,93.19 76.73,99.35 TP1.TP
  Bottom 0.15: v12.19,62.79 23.34,62.79 23.82,62.3 27.42,62.3 38.43,73.31 56.85,73.31 v76.73,93.19
USB_D+  (via drill 0.3)
  Top 0.15: v150.13,47.76 150.69,48.31 150.97,48.31 D1.4 | v102.84,53.37 v136.28,53.37 | v35.32,48.66 28.53,48.66 24.03,44.16 U2.14
  Bottom 0.15: v150.13,47.76 141.89,47.76 v136.28,53.37 | v102.84,53.37 85.66,53.37 84.69,54.34 70.57,54.34 64.89,48.66 v35.32,48.66
USB_D-  (via drill 0.3)
  Top 0.15: v150,50.32 150.97,50.32 D1.6 | v50.48,44.23 v62.95,56.69 | v23.61,45.27 22.71,44.37 22.71,44.16 U2.13
  Bottom 0.15: v150,50.32 139.95,50.32 133.58,56.69 v62.95,56.69 | v50.48,44.23 24.65,44.23 v23.61,45.27
VBAT  (via drill 0.3)
  Top 0.3: U5.3 127.42,49.56 128.46,50.6 131.09,50.6 C2_BAT.1 131.23,50.53 135.59,50.53 v135.73,50.46 135.73,49.35 135.87,49.21 135.94,49.07 | U4.2 136.42,49.56 136.42,49.14 U4.3 136.28,49.07 135.94,49.07 | 135.94,49.07 135.66,48.8 135.66,46.1 Q1.3 | v135.73,52.05 138.85,55.17 138.85,63.82 TP3.TP
  Bottom 0.3: v135.73,50.46 v135.73,52.05
VBUS  (via drill 0.3)
  Top 0.3: R1_PWRUSB.2 115.37,33.22 117.17,33.22 D2.2 117.45,33.56 117.45,44.99 118.69,46.23 118.76,46.37 | 118.76,46.37 121.88,46.37 122.23,46.72 122.23,47.62 C1_BAT.1 | 118.76,46.37 116.41,48.73 116.41,49.84 116.62,50.04 121.47,50.04 122.09,49.42 CHG_LED.A 122.23,49.35 124.58,49.35 124.72,49.49 U5.4 124.86,49.42 v125.9,49.42 | C5_USB.1 153.32,51.36 150.27,51.36 149.44,50.53 149.44,49.84 148.96,49.35 148.54,49.35 D1.2 148.4,49.21 146.6,49.21 146.05,48.66 C4_USB.1 | 144.21,46.82 145.91,48.52 C4_USB.1 | 144.21,46.82 143,45.61 136.98,45.61 135.38,44.02 134.69,44.02 Q1.1 134.55,44.09 v129.22,49.42 | TP14.TP 142.86,63.76 142.86,51.64 145.84,48.66 C4_USB.1 | 144.21,46.82 150.9,40.14 PFMF.050.1.2
  Bottom 0.3: v129.22,49.42 v125.9,49.42
VRTC  (via drill 0.3)
  Top 0.3: 76.94,54.75 77.84,54.75 79.98,56.9 C10_SUPERCAP.1 | 76.94,54.75 76.24,54.75 C8.1 | v72.3,65.69 72.3,66.73 R_CAPACITOR.2 | 70.01,56.76 70.01,55.03 U3.14 | 70.01,56.76 v70.01,60.85 | 76.94,54.75 76.94,56.48 76.66,56.76 70.01,56.76
  Bottom 0.3: v72.3,65.69 72.3,63.13 v70.01,60.85
VUSB  (via drill 0.3)
  Top 0.3: J2.A4 164.4,51.77 164.4,51.98 J2.B9 164.54,52.05 165.09,52.05 v165.37,52.33 | J2.A9 164.4,56.83 164.4,56.55 J2.B4 164.54,56.48 165.16,56.48 v165.37,56.28 | v147.57,41.25 146.46,40.14 PFMF.050.1.1
  Bottom 0.3: v165.37,56.28 v165.37,52.33 165.23,52.26 158.58,52.26 v147.57,41.25